# Altium project DOD Overdrive.PrjPcb
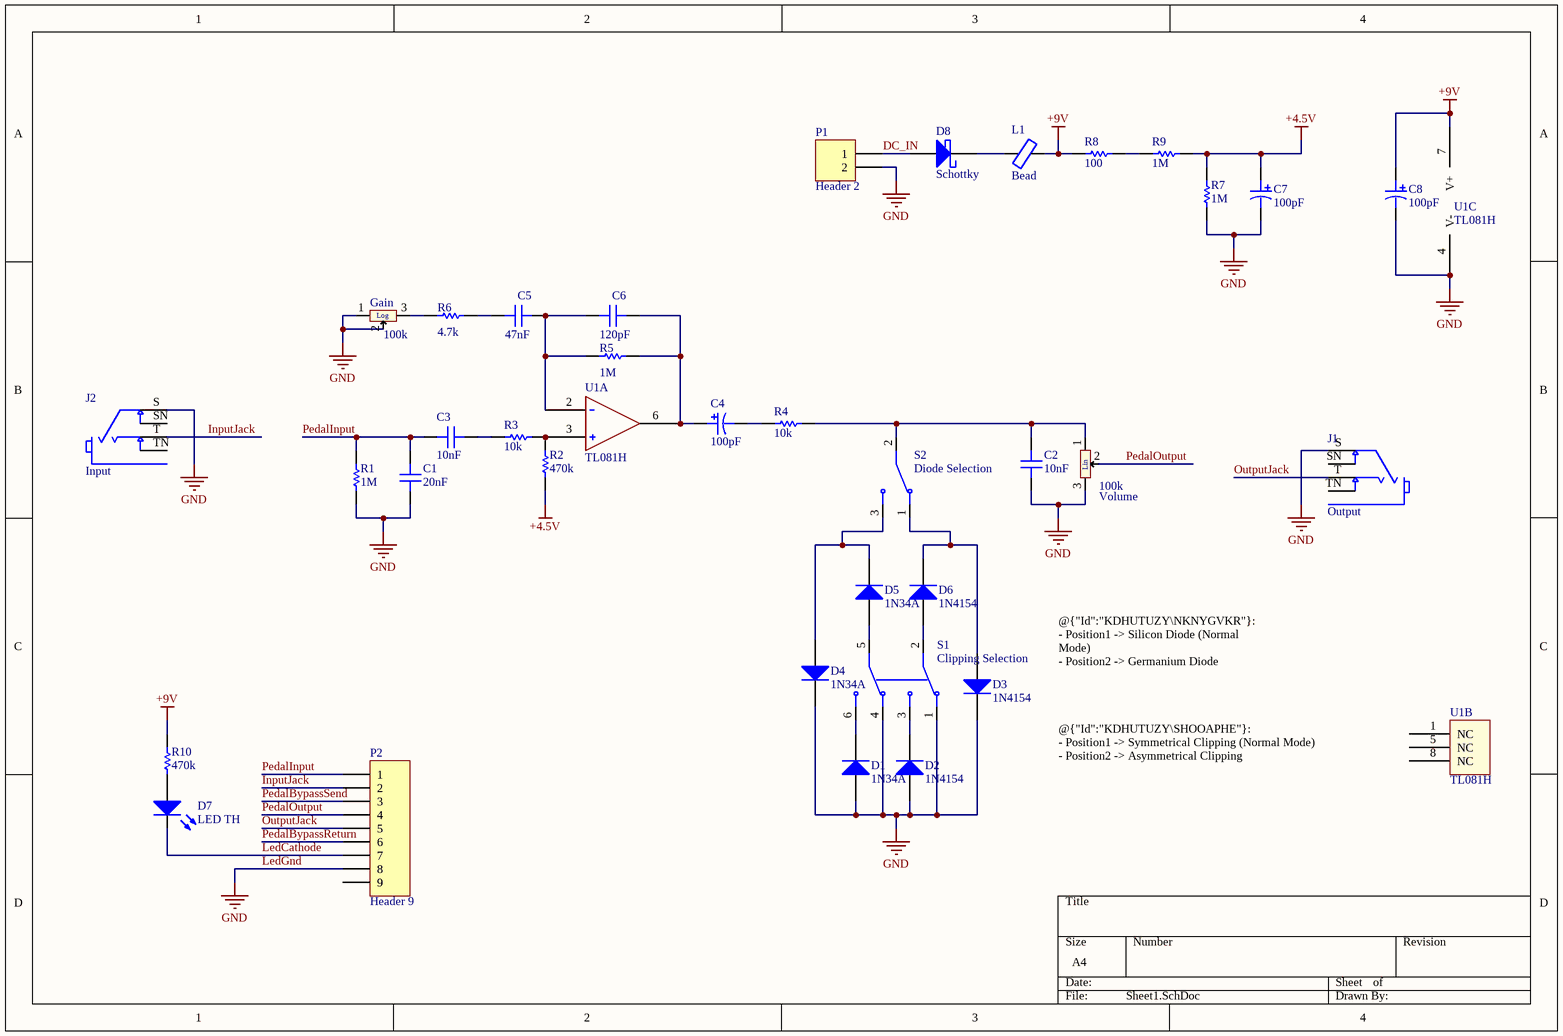
[diagram p0: Sheet1.SchDoc]
1 sheet, 36 parts. Net scope: global (net labels, ports and power ports of the same name join across sheets).
Board file: DOD Overdrive.PcbDoc

## Sheet Sheet1.SchDoc
size A4; SheetNumber: 1; SheetTotal: 1

### Parts
C1  value 20nF  [SMD_0603]  (hidden comment: Cap)
C2  value 10nF  [SMD_0603]  (hidden comment: Cap)
C3  value 10nF  [SMD_0603]  (hidden comment: Cap)
C4  value 100pF  [SMD_0805]  (hidden comment: Cap Pol)
C5  value 47nF  [SMD_0603]  (hidden comment: Cap)
C6  value 120pF  [SMD_0603]  (hidden comment: Cap)
C7  value 100pF  [SMD_0805]  (hidden comment: Cap Pol)
C8  value 100pF  [SMD_0805]  (hidden comment: Cap Pol)
D1  1N34A  [DO-7]
D2  1N4154  [DO-35]
D3  1N4154  [DO-35]
D4  1N34A  [DO-7]
D5  1N34A  [DO-7]
D6  1N4154  [DO-35]
D7  LED TH  [LED5mm]
D8  Schottky  [SOD123]
Gain  value 100k  Type: Log  [PDB181K420K103B]  (hidden comment: Potentiometer, Logarithmic)
J1  Output  [NEUTRIK_NMJ4HCD2]
J2  Input  [NEUTRIK_NMJ4HCD2]
L1  Bead  [SMD_0805]
P1  Header 2  [HDR1X2_2.54]
P2  Header 9  [HDR1X9_2.54]
R1  value 1M  [SMD_0603]  (hidden comment: Res)
R2  value 470k  [SMD_0603]  (hidden comment: Res)
R3  value 10k  [SMD_0603]  (hidden comment: Res)
R4  value 10k  [SMD_0603]  (hidden comment: Res)
R5  value 1M  [SMD_0603]  (hidden comment: Res)
R6  value 4.7k  [SMD_0603]  (hidden comment: Res)
R7  value 1M  [SMD_0805]  (hidden comment: Res)
R8  value 100  [SMD_0805]  (hidden comment: Res)
R9  value 1M  [SMD_0805]  (hidden comment: Res)
R10  value 470k  [SMD_0603]  (hidden comment: Res)
S1  Clipping Selection  [SW_200MDP1T1B1M2QEH]
S2  Diode Selection  [SW_200MSP1T2B4M2QE]
U1  TL081H  [SOIC127P600X175-8N]  (parts A,B,C of 3)
Volume  value 100k  Type: Lin  [PDB181K420K103B]  (hidden comment: Potentiometer, Linear)

### Nets
+4.5V: C7.2 R2.2 R7.1 R9.1
+9V: C8.2 L1.2 R8.2 R10.1 U1.7(V+)
GND: C1.2 C2.2 C7.1 C8.1 D1.1(A) D2.1(A) D3.2(K) D4.2(K) Gain.1 Gain.2 J1.S J2.S P1.2 P2.8 R1.2 R7.2 S1.1(NC1) S1.4(NC2) U1.4(V-) Volume.3  [also labelled LedGnd]
DC_IN: D8.1(A) P1.1
InputJack: J2.T P2.2
LedCathode: D7.2(K) P2.7
OutputJack: J1.T P2.5
PedalBypassReturn: P2.6
PedalBypassSend: P2.3
PedalInput: C1.1 C3.2 P2.1 R1.1
PedalOutput: P2.4 Volume.2
NetC2_1: C2.1 R4.1 S2.2 Volume.1
NetC3_1: C3.1 R3.2
NetC4_1: C4.1 R4.2
NetC4_2: C4.2 C6.2 R5.2 U1.6
NetC5_1: C5.1 R6.2
NetC5_2: C5.2 C6.1 R5.1 U1.2
NetD1_2: D1.2(K) S1.6(NO2)
NetD2_2: D2.2(K) S1.3(NO1)
NetD3_1: D3.1(A) D6.2(K) S2.1
NetD4_1: D4.1(A) D5.2(K) S2.3
NetD5_1: D5.1(A) S1.5(COM2)
NetD6_1: D6.1(A) S1.2(COM1)
NetD7_1: D7.1(A) R10.2
NetD8_2: D8.2(K) L1.1
NetGain_3: Gain.3 R6.1
NetR2_1: R2.1 R3.1 U1.3
NetR8_1: R8.1 R9.2

Not connected (* = marked no-connect by the designer): J1 SN TN; J2 SN TN; P2 9; U1 1(NC) 5(NC) 8(NC)

### Notes on the sheet
- @{"Id":"KDHUTUZY\NKNYGVKR"}:
  - Position1 -> Silicon Diode (Normal Mode)
  - Position2 -> Germanium Diode
- Type @ to refer to a designator or a net
- @{"Id":"KDHUTUZY\SHOOAPHE"}:
  - Position1 -> Symmetrical Clipping (Normal Mode)
  - Position2 -> Asymmetrical Clipping

### Library data of the parts
C1-C3 C5 C6 = Cap: Capacitor; Published: 8-Jun-2000; LatestRevisionDate: 17-Jul-2002; LatestRevisionNote: Re-released for DXP Platform.; PackageReference: RAD-0.3; Publisher: Altium Limited; PackageDescription: Radial Cap, Thru-Hole; 2 Leads; 0.3 in Pin Spacing
C4 C7 C8 = Cap Pol: Polarized Capacitor; Published: 8-Jun-2000; LatestRevisionDate: 17-Jul-2002; LatestRevisionNote: Re-released for DXP Platform.; PackageReference: POLAR0.8; Publisher: Altium Limited; PackageDescription: Polarized Capacitor; 2 Leads
D1 D4 D5 = Diode 1N434A: Germanium Diode; Published: 8-Jun-2000; LatestRevisionDate: 17-Jul-2002; LatestRevisionNote: Re-released for DXP Platform.; DatasheetVersion: 1997; PackageReference: DO-35; Publisher: Altium Limited; PackageDescription: Diode, Axial; Body 3.8 x 1.9 mm (LxDia. max), Lead Dia. 0.53 mm (max); Code_JEDEC: DO-204-AH; ComponentLink1Description: Manufacturer Link; ComponentLink1URL: http://www.fairchildsemi.com/
D2 D3 D6 = Diode 1N4154: High Conductance Ultra Fast Diode; Published: 8-Jun-2000; LatestRevisionDate: 17-Jul-2002; LatestRevisionNote: Re-released for DXP Platform.; DatasheetVersion: 1997; PackageReference: DO-35; Publisher: Altium Limited; PackageDescription: Diode, Axial; Body 3.8 x 1.9 mm (LxDia. max), Lead Dia. 0.53 mm (max); Code_JEDEC: DO-204-AH; ComponentLink1Description: Manufacturer Link; ComponentLink1URL: http://www.fairchildsemi.com/
D7 = LED TH, 5mm: Typical RED, GREEN, YELLOW, AMBER GaAs LED; Published: 8-Jun-2000; LatestRevisionDate: 17-Jul-2002; LatestRevisionNote: Re-released for DXP Platform.; PackageVersion: Feb-2002; PackageReference: 3.2X1.6X1.1; Publisher: Altium Limited; PackageDescription: SM LED; 2 Flat Leads
D8 = Diode Schottky: Schottky Diode; Published: 8-Jun-2000; LatestRevisionDate: 17-Jul-2002; LatestRevisionNote: Re-released for DXP Platform.; DatasheetVersion: 1997; PackageReference: DO-35; Publisher: Altium Limited; PackageDescription: Diode, Axial; Body 3.8 x 1.9 mm (LxDia. max), Lead Dia. 0.53 mm (max); Code_JEDEC: DO-204-AH; ComponentLink1Description: Manufacturer Link; ComponentLink1URL: http://www.fairchildsemi.com/
Gain = Potentiometer, Logarithmic: Logarithmic Potentiometer, TH, 5.08mm
J1 J2 = NMJ4HCD2: 1/4 mono jack, switched, with chrome ferrule and straight PCB pins, mounting nut included; MF: Neutrik; Purchase-URL: https://pricing.snapeda.com/search/part/NMJ4HCD2/?ref=eda; Package: None; MP: NMJ4HCD2; Price: None; Availability: In Stock; Value: *; Check_prices: https://www.snapeda.com/parts/NMJ4HCD2/Neutrik/view-part/?ref=eda; SnapEDA_Link: https://www.snapeda.com/parts/NMJ4HCD2/Neutrik/view-part/?ref=snap
L1 = Bead: Ferrite Bead
P1 = Header 2: Header, 2-Pin; LatestRevisionDate: 17-Jul-2002; LatestRevisionNote: Re-released for DXP Platform.; Publisher: Altium Limited
P2 = Header 9: Header, 9-Pin; LatestRevisionDate: 17-Jul-2002; LatestRevisionNote: Re-released for DXP Platform.; Publisher: Altium Limited
R1-R10 = Res: Resistor; Published: 8-Jun-2000; LatestRevisionDate: 17-Jul-2002; LatestRevisionNote: Re-released for DXP Platform.; PackageReference: SMD; Publisher: Altium Limited
S1 = 200MDP1T1B1M2QEH: MP: 200MDP1T1B1M2QEH; Availability: Unavailable; Package: None; Price: None; Value: *
S2 = 200MSP1T2B4M2QE: Price: None; MP: 200MSP1T2B4M2QE; Availability: Unavailable; Package: None; Value: *
U1 = TL081H: Opamp Single
Volume = Potentiometer, Linear: Linear Potentiometer, TH, 5.08mm3